# Altium schematic sheet button.SchDoc
size A4; SheetNumber: 10; SheetTotal: 11
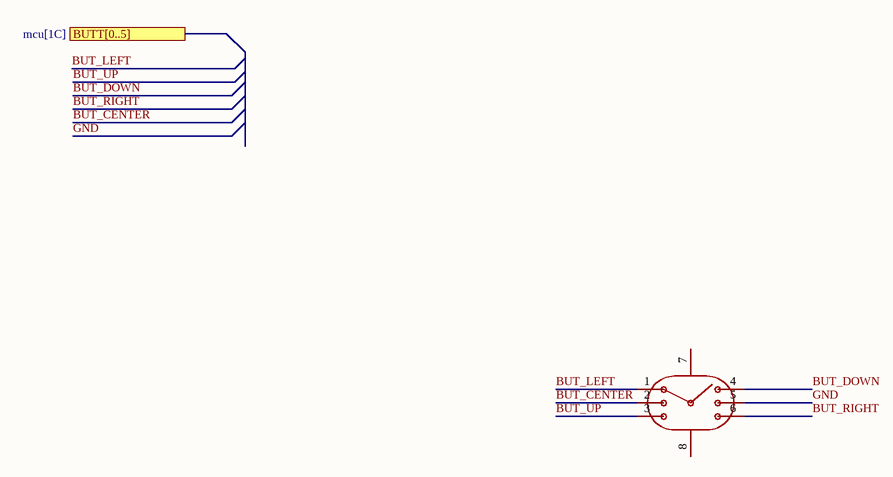
[diagram p0: button.SchDoc]

## Parts
SW1  K1-5202UA-01  [SW-SMD_K1-5202UA-01]  (value not drawn)

## Ports
BUTT[0..5] (see mcu[1C])

## Nets
BUT_CENTER: SW1.2(B)
BUT_DOWN: SW1.4(CENTER)
BUT_LEFT: SW1.1(A)
BUT_RIGHT: SW1.6(COMMON)
BUT_UP: SW1.3(C)
GND: SW1.5(D)

Not connected (* = marked no-connect by the designer): SW1 7(COMMON) 8(COMMON)

## Library data of the parts
SW1 = K1-5202UA-01: Manufacturer: Korean Hroparts Elec; MFR.Part #: K1-5202UA-01; JLCPCB Part #: C136710